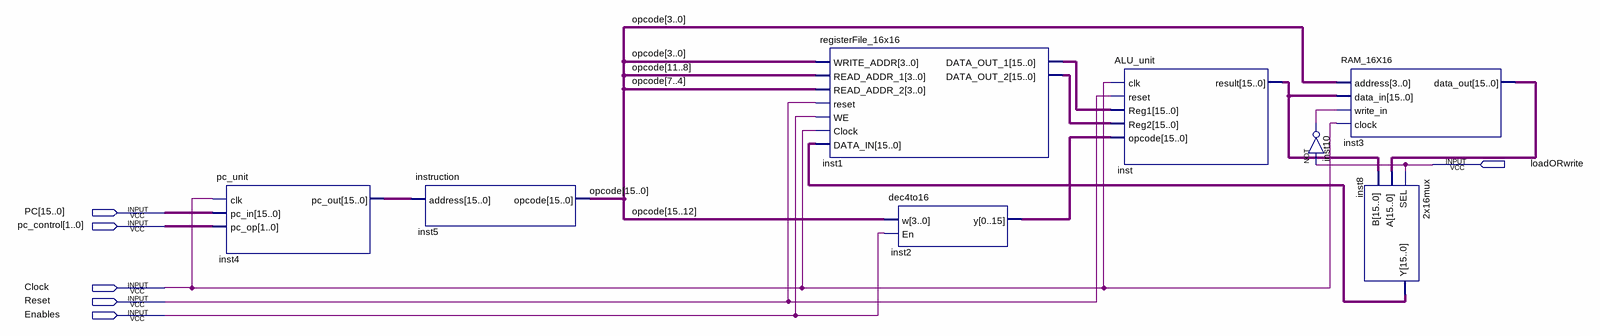
[diagram p0: schematic sheet]
// Quartus schematic 16bitCPU.bdf as structural Verilog: 8 symbols, 6 pins
module \16bitCPU  (
  input  loadORwrite,
  input  [15:0] PC,
  input  [1:0] pc_control,
  input  Clock,
  input  Reset,
  input  Enables
);

  wire inst10_out;
  wire [15:0] inst1_data_out_1, inst1_data_out_2, inst2_y, inst3_data_out, inst4_pc_out, inst8_y,
       inst_result, opcode;

  pc_unit inst4 (.clk(Clock), .pc_in(PC), .pc_op(pc_control), .pc_out(inst4_pc_out));
  instruction inst5 (.address(inst4_pc_out), .opcode(opcode));
  registerFile_16x16 inst1 (
    .WRITE_ADDR(opcode[3:0]), .READ_ADDR_1(opcode[11:8]), .READ_ADDR_2(opcode[7:4]), .reset(Reset),
    .WE(Enables), .Clock(Clock), .DATA_IN(inst8_y), .DATA_OUT_1(inst1_data_out_1),
    .DATA_OUT_2(inst1_data_out_2));
  dec4to16 inst2 (.w(opcode[15:12]), .En(Enables), .y(inst2_y));
  ALU_unit inst (
    .clk(Clock), .reset(Reset), .Reg1(inst1_data_out_1), .Reg2(inst1_data_out_2), .opcode(inst2_y),
    .result(inst_result));
  not inst10 (inst10_out, loadORwrite);
  RAM_16X16 inst3 (
    .address(opcode[3:0]), .data_in(inst_result), .write_in(inst10_out), .clock(Clock),
    .data_out(inst3_data_out));
  \2x16mux  inst8 (.SEL(loadORwrite), .A(inst3_data_out), .B(inst_result), .Y(inst8_y));
endmodule
